# Altium schematic sheet 2 power.SchDoc
size A4; SheetNumber: 2; SheetTotal: 13
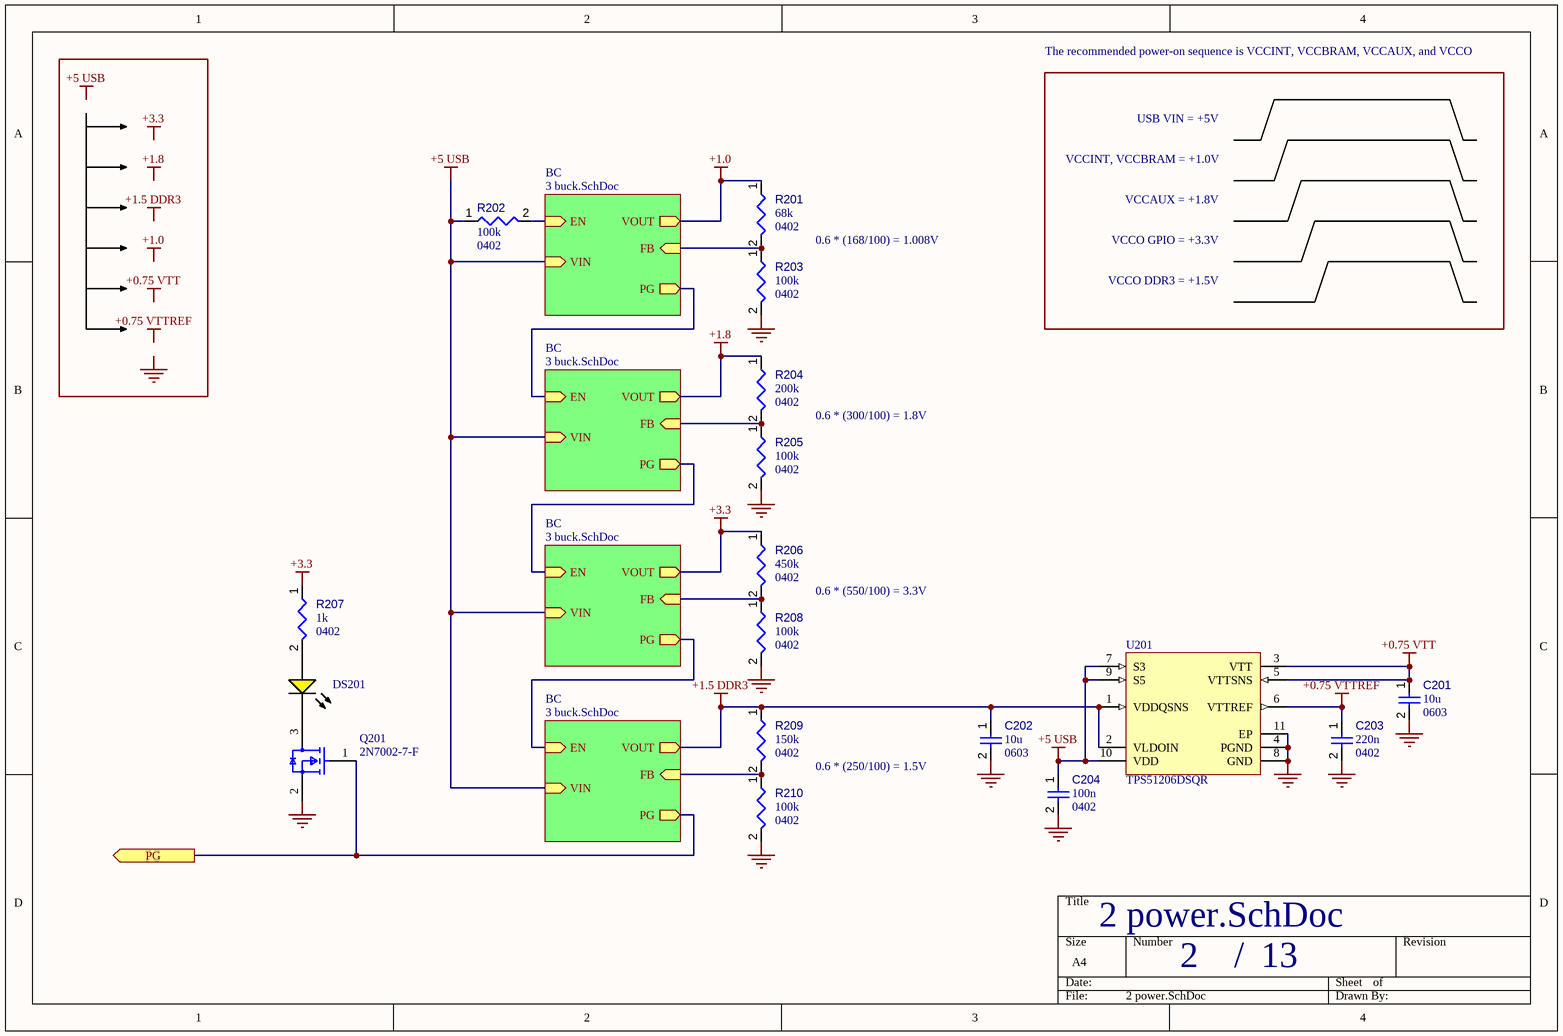
[diagram p0: 2 power.SchDoc]

## Parts
C201  value 10u  Case/Package: 0603  [CAPC0603(1608)100_L]  (hidden comment: Capacitors,0603,10u)
C202  value 10u  Case/Package: 0603  [CAPC0603(1608)100_L]  (hidden comment: Capacitors,0603,10u)
C203  value 220n  Case/Package: 0402  [CAPC0402(1005)60_L]  (hidden comment: Capacitors,0402,220n,16)
C204  value 100n  Case/Package: 0402  [CAPC0402(1005)60_L]  (hidden comment: Capacitors,0402,100n,16)
DS201  SML-LX0603YW-TR  [LUMX-SML-LX0603_V]  (value not drawn)
Q201  2N7002-7-F  [FP-SOT23-MFG]
R201  value 68k  Case/Package: 0402  [RESC0402(1005)_L]  (hidden comment: Resistors,0402,1%,68k)
R202  value 100k  Case/Package: 0402  [RESC0402(1005)_L]  (hidden comment: Resistors,0402,1%,100k)
R203  value 100k  Case/Package: 0402  [RESC0402(1005)_L]  (hidden comment: Resistors,0402,1%,100k)
R204  value 200k  Case/Package: 0402  [RESC0402(1005)_L]  (hidden comment: Resistors,0402,1%,200k)
R205  value 100k  Case/Package: 0402  [RESC0402(1005)_L]  (hidden comment: Resistors,0402,1%,100k)
R206  value 450k  Case/Package: 0402  [RESC0402(1005)_L]  (hidden comment: Resistors,0402,1%,450k)
R207  value 1k  Case/Package: 0402  [RESC0402(1005)_L]  (hidden comment: Resistors,0402,1k)
R208  value 100k  Case/Package: 0402  [RESC0402(1005)_L]  (hidden comment: Resistors,0402,1%,100k)
R209  value 150k  Case/Package: 0402  [RESC0402(1005)_L]  (hidden comment: Resistors,0402,1%,150k)
R210  value 100k  Case/Package: 0402  [RESC0402(1005)_L]  (hidden comment: Resistors,0402,1%,100k)
U201  TPS51206DSQR  [DSQ0010A_V]

## Sub-sheets
BC = 3 buck.SchDoc: EN (in), FB (in), VOUT (out), PG (out), VIN (in)
BC = 3 buck.SchDoc: EN (in), FB (in), VOUT (out), PG (out), VIN (in)
BC = 3 buck.SchDoc: EN (in), FB (in), VOUT (out), PG (out), VIN (in)
BC = 3 buck.SchDoc: EN (in), FB (in), VOUT (out), PG (out), VIN (in)

## Ports
PG (out)

## Nets
+0.75 VTT: C201.1 U201.3(VTT) U201.5(VTTSNS)
+0.75 VTTREF: C203.1 U201.6(VTTREF)
+1.0: R201.1 ; sheet BC/VOUT
+1.5 DDR3: C202.1 R209.1 U201.1(VDDQSNS) U201.2(VLDOIN) ; sheet BC/VOUT
+1.8: R204.1 ; sheet BC/VOUT
+3.3: R206.1 R207.1 ; sheet BC/VOUT
+5 USB: C204.1 R202.1 U201.7(S3) U201.9(S5) U201.10(VDD) ; sheet BC/VIN, sheet BC/VIN, sheet BC/VIN, sheet BC/VIN
GND: C201.2 C202.2 C203.2 C204.2 Q201.2(S) R203.2 R205.2 R208.2 R210.2 U201.4(PGND) U201.8(GND) U201.11(EP)
PG: Q201.1(G) ; port PG, sheet BC/PG
NetDS201_1: DS201.1(A) R207.2
NetDS201_2: DS201.2(K) Q201.3(D)
NetR201_2: R201.2 R203.1 ; sheet BC/FB
NetR202_2: R202.2 ; sheet BC/EN
NetR204_2: R204.2 R205.1 ; sheet BC/FB
NetR206_2: R206.2 R208.1 ; sheet BC/FB
NetR209_2: R209.2 R210.1 ; sheet BC/FB
(unnamed): sheet BC/PG, sheet BC/EN
(unnamed): sheet BC/PG, sheet BC/EN
(unnamed): sheet BC/PG, sheet BC/EN

## Notes on the sheet
- The recommended power-on sequence is VCCINT, VCCBRAM, VCCAUX, and VCCO
- VCCINT, VCCBRAM = +1.0V
- USB VIN = +5V
- 0.6 * (168/100) = 1.008V
- VCCAUX = +1.8V
- VCCO GPIO = +3.3V
- VCCO DDR3 = +1.5V
- 0.6 * (300/100) = 1.8V
- 0.6 * (550/100) = 3.3V
- 0.6 * (250/100) = 1.5V
- /
- Labels drawn without touching a wire or pin: +0.75 VTT, +0.75 VTTREF, +1.0, +1.5 DDR3, +1.8, +3.3, +5 USB, GND

## Library data of the parts
C201 C202 = Capacitors: Capacitor; Component Type: Capacitors
C203 C204 = Capacitors: Capacitor; Voltage Rating: 16; Component Type: Capacitors
DS201 = CMP-2000-07121-1: Yellow LED, Milky White Diffused Lens, 2.1 V, 14 mcd, -25 to 85 degC, 2-Pin SMD, RoHS, Tape and Reel; Manufacturer: Lumex; COO: CN; Number of LEDs: 1; Type: Uni-Color; Intensity: 14mcd; Reverse Voltage: 5(Min)V; LED Material: GaAsP; Viewing Angle: 160; Peak Wavelength: 585nm; Pin_Count: 2; Lens Appearance: ColorlessDiffused; Operating Temperature: -25to85C; Color: Yellow; Mounting Technology: SurfaceMount; Package Description: 2-Pin Surface Mount Device, Body 1.6 x 0.8 mm; Mounting: SurfaceMount; Packaging: TapeandReel; RoHS: Unknown; Supplier_Package: SMD; Package Reference: SML-LX00603; Part No: SML-LX0603YW-TR; Datasheet URL: http://www.lumex.com/content/files/ProductAttachment/SML-LX0603YW-TR.pdf; Dimension: 1.6x0.8x0.6mm; Manufacturer URL: http://www.lumexinstruments.com/; HTS: 8541402000; Datasheet Version: Rev. G, 09/2013; Lens Dimensions: 1x0.8x0.3mm; Dominant Wavelength: N/A; ECCN: EARII; Supplier: Lumex; Family: SML-LX0603YW
Q201 = CMP-2000-04929-2: MOSFET N-CH 60V 115MA SOT23-3; Turn-On Delay Time: 7ns; Turn-Off Delay Time: 11ns; Drain to Source Resistance: 7.5R; Rise Time: 3ns; Drain to Source Breakdown Voltage: 70V; Input Capacitance: 50pF; Number of Elements: 1; Power Dissipation: 540mW; Max Power Dissipation: 300mW; Fall Time: 5.6ns; Gate to Source Voltage (Vgs): 20V; Threshold Voltage: 2.5V; Element Configuration: Single; Termination: SMD/SMT; Weight: 0.000282oz; Radiation Hardening: No; Max Operating Temperature: 150°C; On-State Resistance: 7.5R; Mount: Surface Mount; Current Rating: 115mA; Contact Plating: Tin; Lead Free: Lead Free; Min Operating Temperature: -55°C; Number of Pins: 3; REACH SVHC: No SVHC; Drain to Source Voltage (Vdss): 60V; Width: 1.3mm; Package Quantity: 3000; Length: 2.9mm; Case/Package: SOT-23; Number of Channels: 1; Dual Supply Voltage: 60V; Packaging: Tape and Reel; Height: 1mm; Voltage Rating (DC): 60V; Nominal Vgs: 2.5V; Continuous Drain Current (ID): 115mA; Voltage: 60V; Rds On Max: 7.5R
R201-R210 = Resistors: Resistor; Component Type: Resistors
  R201-R206 R208-R210: Tolerance: 1%
U201 = CMP-0395-00678-2: Single Output LDO, 2 A, with VTTREF Buffered Reference for DDR2, DDR3, DDR3L, 10-pin SON (DSQ), -40 to 85 degC, Green (RoHS & no Sb/Br); Manufacturer: Texas Instruments; SubFamily: Single Channel LDO; Iout(Max)(A): 2; Rating: Catalog; ComponentLink2Description: Datasheet; ComponentLink1URL: http://www.ti.com/; ComponentLink4URL: Samples URL:http://www.ti.com/product/tps51206#samples; PackageVersion: 4209243/B; Mounting Technology: Surface Mount; PackageReference: DSQ0010A; Eco-Plan: Green (RoHS & no Sb/Br); PackageDescription: 10-Pin Plastic Small Outline, Body 2 X 2 mm, Pitch 0.4 mm; ComponentLink4Description: URL Link1; DatasheetVersion: SLUSAH1; ComponentLink3URL: http://www.ti.com/litv/pdf/mpdi002c; ComponentLink2URL: http://www.ti.com/general/docs/lit/getliterature.tsp?genericPartNumber=TPS51206&fileType=pdf; PartNumber: TPS51206DSQR; ComponentLink3Description: Package Specification; ComponentLink1Description: Manufacturer URL